# EAGLE design v2 (EAGLE 9.5.0)

## Sheet 1 of 6
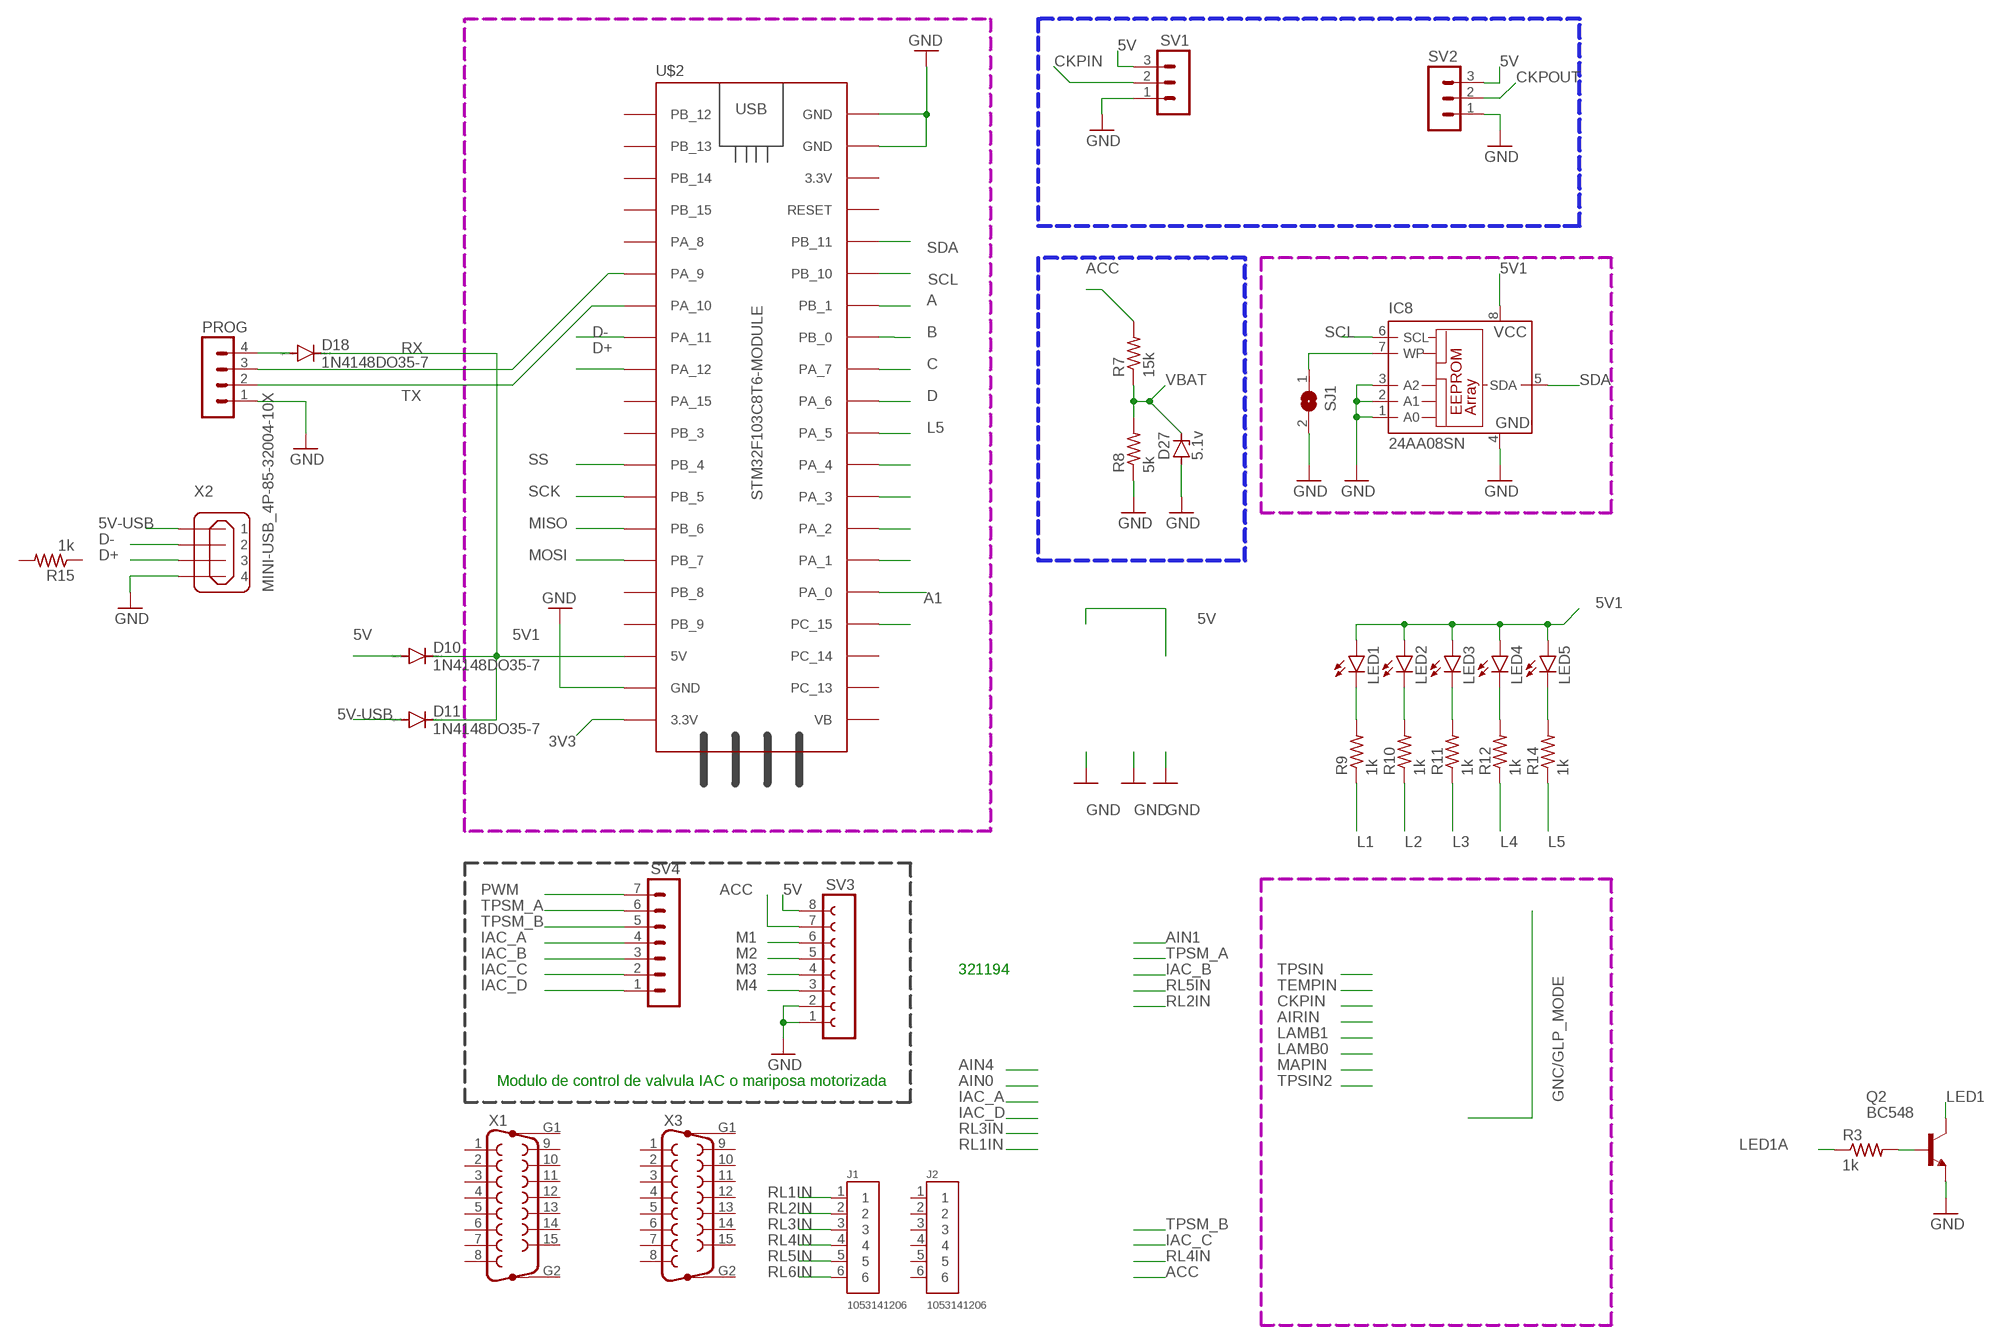
[diagram p0: schematic, sheet 1]

### Parts
D10  1N4148DO35-7  [DO35-7]
D11  1N4148DO35-7  [DO35-7]
D18  1N4148DO35-7  [DO35-7]
D27  5.1v  ZENER-DIODEZD-5  [ZDIO-5]
IC8  24AA08SN  [SO-08]
J1  1053141206  [MOLEX_1053141206]
J2  1053141206  [MOLEX_1053141206]
LED1  LED3MM  [LED3MM]
LED2  LED3MM  [LED3MM]
LED3  LED3MM  [LED3MM]
LED4  LED3MM  [LED3MM]
LED5  LED3MM  [LED3MM]
PROG  MA04-1  [MA04-1]
Q2  BC548  [TO92-EBC]
R3  1k  R-US_0204/5  [0204/5]
R7  15k  R-US_0204/5  [0204/5]
R8  5k  R-US_0204/5  [0204/5]
R9  1k  R-US_0204/5  [0204/5]
R10  1k  R-US_0204/5  [0204/5]
R11  1k  R-US_0204/5  [0204/5]
R12  1k  R-US_0204/5  [0204/5]
R14  1k  R-US_0204/5  [0204/5]
R15  1k  R-US_0204/5  [0204/5]
SJ1  SJW  [SJW]
SV1  MA03-1  [MA03-1]
SV2  MA03-1  [MA03-1]
SV3  FE08-1  [FE08]
SV4  MA07-1  [MA07-1]
U$2  STM32F103C8T6-MODULE  [STM32F103C8T6-MODULE]
X1  F15HP  [F15HP]
X2  MINI-USB_4P-85-32004-10X  [85-32004-10X]
X3  F15HP  [F15HP]

### Nets
3V3: U$2.3.3V_1(3.3V) ; also sheet 4
5V: D10.A SV1.3 SV2.3 SV3.8 ; also sheet 2,5
5V1: D10.C D11.C D18.C IC8.8(VCC) LED1.A LED2.A LED3.A LED4.A LED5.A U$2.5V
5V-USB: D11.A X2.1
A: U$2.PB_1 ; also sheet 2
A1: U$2.PA_0 ; also sheet 4
ACC: R7.2 SV3.7 ; also sheet 3
B: U$2.PB_0 ; also sheet 2
C: U$2.PA_7 ; also sheet 2
CKPIN: SV1.2
CKPOUT: SV2.2 ; also sheet 2
D: U$2.PA_6 ; also sheet 2
D+: U$2.PA_12 X2.3
D-: U$2.PA_11 X2.2
GND: D27.A IC8.1(A0) IC8.2(A1) IC8.3(A2) IC8.4(GND) PROG.1 Q2.E R8.1 SJ1.2 SV1.1 SV2.1 SV3.1 SV3.2 U$2.GND_1(GND) U$2.GND_2(GND) U$2.GND_3(GND) X2.4 ; also sheet 2,3,4,5
IAC_A: SV4.4
IAC_B: SV4.3
IAC_C: SV4.2
IAC_D: SV4.1
L1: R9.1
L2: R10.1
L3: R11.1
L4: R12.1
L5: R14.1 U$2.PA_5
LED1: Q2.C
LED1A: R3.1
M1: SV3.6 ; also sheet 2
M2: SV3.5 ; also sheet 2
M3: SV3.4 ; also sheet 2
M4: SV3.3 ; also sheet 2
MISO: U$2.PB_6
MOSI: U$2.PB_7
N$12: LED1.K(C) R9.2
N$13: LED2.K(C) R10.2
N$14: Q2.B R3.2
N$15: LED3.K(C) R11.2
N$16: LED4.K(C) R12.2
N$17: LED5.K(C) R14.2
N$21: U$2.PC_15
N$22: U$2.PA_1
N$23: U$2.PA_2
N$24: U$2.PA_3
N$26: U$2.PA_4
N$34: IC8.7(WP) SJ1.1
N$35: D18.A PROG.4
PWM: SV4.7 ; also sheet 2
RL1IN: J1.1 ; also sheet 4
RL2IN: J1.2 ; also sheet 4
RL3IN: J1.3 ; also sheet 4
RL4IN: J1.4 ; also sheet 4
RL5IN: J1.5 ; also sheet 4
RL6IN: J1.6 ; also sheet 4
RX: PROG.3 U$2.PA_9
SCK: U$2.PB_5
SCL: IC8.6(SCL) U$2.PB_10 ; also sheet 2
SDA: IC8.5(SDA) U$2.PB_11 ; also sheet 2
SS: U$2.PB_4
TPSM_A: SV4.6
TPSM_B: SV4.5
TX: PROG.2 U$2.PA_10
VBAT: D27.C R7.1 R8.2 ; also sheet 2
Unconnected: J2.1 J2.2 J2.3 J2.4 J2.5 J2.6 R15.1 R15.2 U$2.3.3V_2(3.3V) U$2.PA_8 U$2.PA_15 U$2.PB_3 U$2.PB_8 U$2.PB_9 U$2.PB_12 U$2.PB_13 U$2.PB_14 U$2.PB_15 U$2.PC_13 U$2.PC_14 U$2.RESET U$2.VB X1.1 X1.2 X1.3 X1.4 X1.5 X1.6 X1.7 X1.8 X1.9 X1.10 X1.11 X1.12 X1.13 X1.14 X1.15 X1.G1 X1.G2 X3.1 X3.2 X3.3 X3.4 X3.5 X3.6 X3.7 X3.8 X3.9 X3.10 X3.11 X3.12 X3.13 X3.14 X3.15 X3.G1 X3.G2

### Notes on the sheet
- 321194
- Modulo de control de valvula IAC o mariposa motorizada

## Sheet 2 of 6: IO Principal
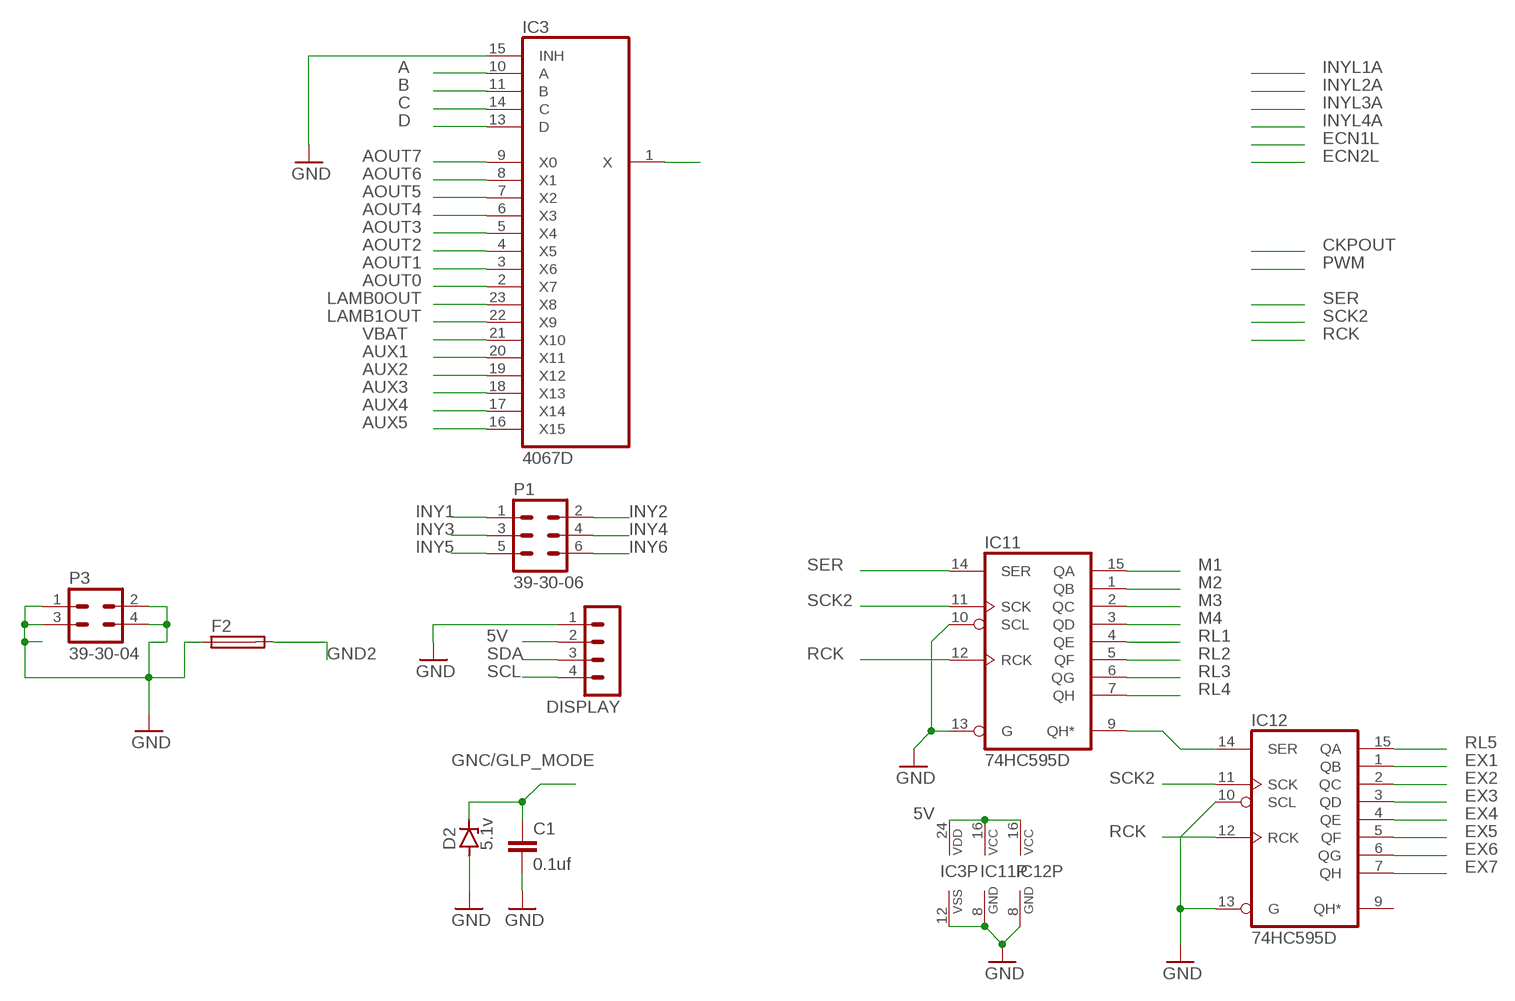
[diagram p1: schematic, sheet 2]

### Parts
C1  0.1uf  C-EU025-025X050  [C025-025X050]
D2  5.1v  ZENER-DIODEZD-5  [ZDIO-5]
DISPLAY  MA04-1  [MA04-1]
F2  TE5  [TE5]
IC3  4067D  [SO24W]
IC11  74HC595D  [SO16]
IC12  74HC595D  [SO16]
P1  39-30-06  [39-30-?06?]
P3  39-30-04  [39-30-?04?]

### Nets
5V: DISPLAY.2 IC3.24(VDD) IC11.16(VCC) IC12.16(VCC) ; also sheet 1,5
A: IC3.10(A) ; also sheet 1
A0: IC3.1(X) ; also sheet 4
AOUT0: IC3.2(X7) ; also sheet 5
AOUT1: IC3.3(X6) ; also sheet 5
AOUT2: IC3.4(X5) ; also sheet 5
AOUT3: IC3.5(X4) ; also sheet 5
AOUT4: IC3.6(X3) ; also sheet 5
AOUT5: IC3.7(X2) ; also sheet 5
AOUT6: IC3.8(X1) ; also sheet 5
AOUT7: IC3.9(X0) ; also sheet 5
AUX1: IC3.20(X11)
AUX2: IC3.19(X12)
AUX3: IC3.18(X13)
AUX4: IC3.17(X14)
AUX5: IC3.16(X15)
B: IC3.11(B) ; also sheet 1
C: IC3.14(C) ; also sheet 1
D: IC3.13(D) ; also sheet 1
EX1: IC12.1(QB)
EX2: IC12.2(QC)
EX3: IC12.3(QD)
EX4: IC12.4(QE)
EX5: IC12.5(QF)
EX6: IC12.6(QG)
EX7: IC12.7(QH)
GNC/GLP_MODE: C1.1 D2.C ; also sheet 1
GND: C1.2 D2.A DISPLAY.1 F2.1 IC3.12(VSS) IC3.15(INH) IC11.8(GND) IC11.10(SCL) IC11.13(G) IC12.8(GND) IC12.10(SCL) IC12.13(G) P3.1 P3.2 P3.3 P3.4 ; also sheet 1,3,4,5
GND2: F2.2 ; also sheet 3
INY1: P1.1 ; also sheet 3
INY2: P1.2 ; also sheet 3
INY3: P1.3 ; also sheet 3
INY4: P1.4 ; also sheet 3
INY5: P1.5 ; also sheet 3
INY6: P1.6 ; also sheet 3
LAMB0OUT: IC3.23(X8) ; also sheet 5
LAMB1OUT: IC3.22(X9) ; also sheet 5
M1: IC11.15(QA) ; also sheet 1
M2: IC11.1(QB) ; also sheet 1
M3: IC11.2(QC) ; also sheet 1
M4: IC11.3(QD) ; also sheet 1
N$25: IC11.9(QH*) IC12.14(SER)
RCK: IC11.12(RCK) IC12.12(RCK)
RL1: IC11.4(QE) ; also sheet 4
RL2: IC11.5(QF) ; also sheet 4
RL3: IC11.6(QG) ; also sheet 4
RL4: IC11.7(QH) ; also sheet 4
RL5: IC12.15(QA) ; also sheet 4
SCK2: IC11.11(SCK) IC12.11(SCK)
SCL: DISPLAY.4 ; also sheet 1
SDA: DISPLAY.3 ; also sheet 1
SER: IC11.14(SER)
VBAT: IC3.21(X10) ; also sheet 1
Unconnected: IC12.9(QH*)

## Sheet 3 of 6: Inyectores/Encendido
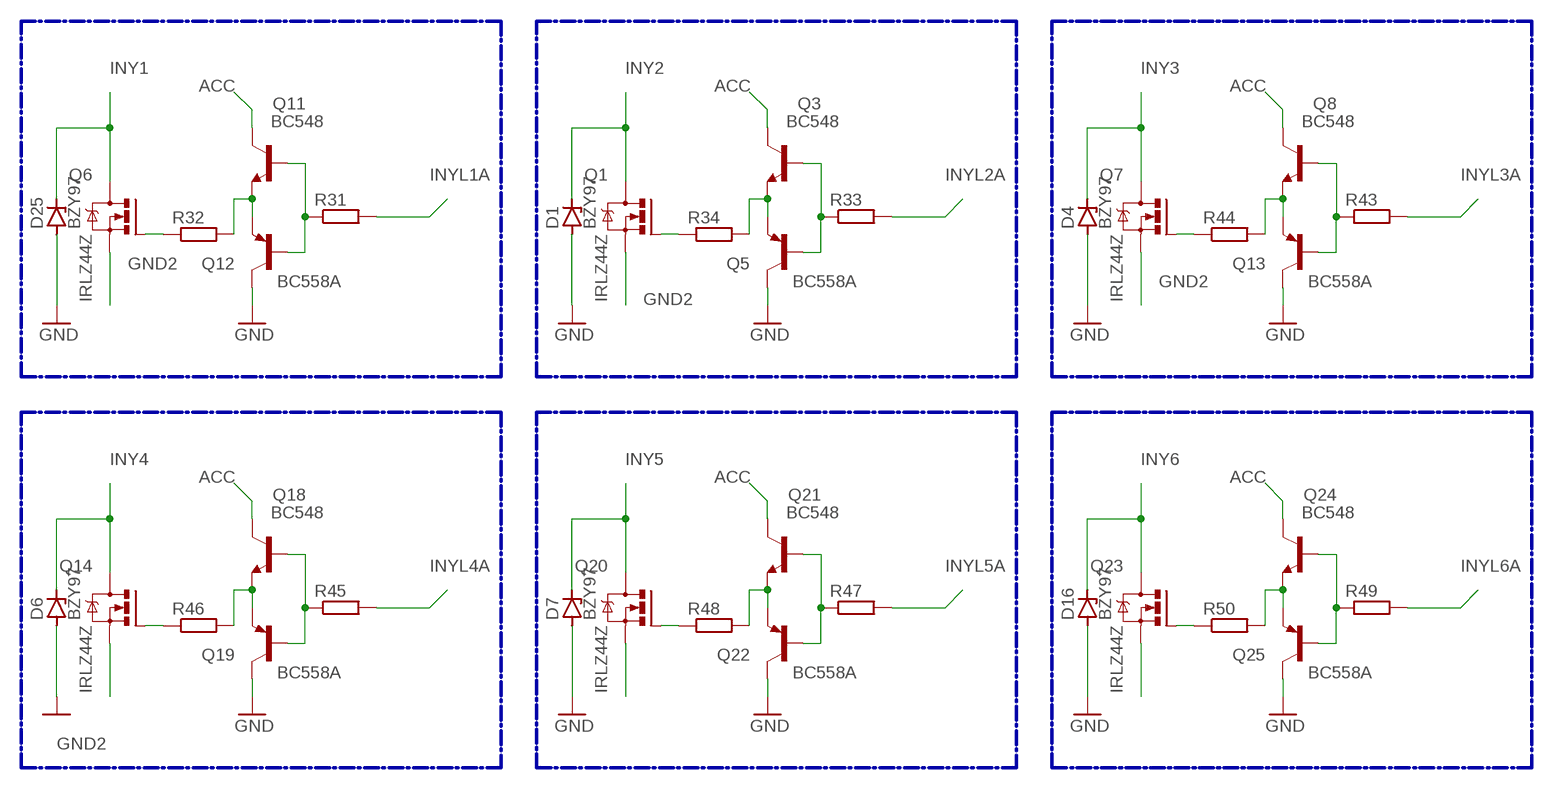
[diagram p2: schematic, sheet 3]

### Parts
D1  BZY97  [F126Z12]
D4  BZY97  [F126Z12]
D6  BZY97  [F126Z12]
D7  BZY97  [F126Z12]
D16  BZY97  [F126Z12]
D25  BZY97  [F126Z12]
Q1  IRLZ44Z  [TO220BH]
Q3  BC548  [TO92-EBC]
Q5  BC558A  [TO92-EBC]
Q6  IRLZ44Z  [TO220BH]
Q7  IRLZ44Z  [TO220BH]
Q8  BC548  [TO92-EBC]
Q11  BC548  [TO92-EBC]
Q12  BC558A  [TO92-EBC]
Q13  BC558A  [TO92-EBC]
Q14  IRLZ44Z  [TO220BH]
Q18  BC548  [TO92-EBC]
Q19  BC558A  [TO92-EBC]
Q20  IRLZ44Z  [TO220BH]
Q21  BC548  [TO92-EBC]
Q22  BC558A  [TO92-EBC]
Q23  IRLZ44Z  [TO220BH]
Q24  BC548  [TO92-EBC]
Q25  BC558A  [TO92-EBC]
R31  R-EU_0207/10  [0207/10]
R32  R-EU_0207/10  [0207/10]
R33  R-EU_0207/10  [0207/10]
R34  R-EU_0207/10  [0207/10]
R43  R-EU_0207/10  [0207/10]
R44  R-EU_0207/10  [0207/10]
R45  R-EU_0207/10  [0207/10]
R46  R-EU_0207/10  [0207/10]
R47  R-EU_0207/10  [0207/10]
R48  R-EU_0207/10  [0207/10]
R49  R-EU_0207/10  [0207/10]
R50  R-EU_0207/10  [0207/10]

### Nets
ACC: Q3.C Q8.C Q11.C Q18.C Q21.C Q24.C ; also sheet 1
GND: D1.A D4.A D6.A D7.A D16.A D25.A Q5.C Q12.C Q13.C Q19.C Q22.C Q25.C ; also sheet 1,2,4,5
GND2: Q1.S Q6.S Q7.S Q14.S Q20.S Q23.S ; also sheet 2
INY1: D25.C Q6.D ; also sheet 2
INY2: D1.C Q1.D ; also sheet 2
INY3: D4.C Q7.D ; also sheet 2
INY4: D6.C Q14.D ; also sheet 2
INY5: D7.C Q20.D ; also sheet 2
INY6: D16.C Q23.D ; also sheet 2
INYL1A: R31.2 ; also sheet 2
INYL2A: R33.2 ; also sheet 2
INYL3A: R43.2 ; also sheet 2
INYL4A: R45.2 ; also sheet 2
INYL5A: R47.2
INYL6A: R49.2
N$2: Q11.B Q12.B R31.1
N$3: Q11.E Q12.E R32.2
N$5: Q3.B Q5.B R33.1
N$6: Q6.G R32.1
N$9: Q3.E Q5.E R34.2
N$10: Q1.G R34.1
N$18: Q8.B Q13.B R43.1
N$20: Q8.E Q13.E R44.2
N$27: Q7.G R44.1
N$28: Q18.B Q19.B R45.1
N$30: Q18.E Q19.E R46.2
N$33: Q14.G R46.1
N$46: Q21.B Q22.B R47.1
N$47: Q21.E Q22.E R48.2
N$48: Q20.G R48.1
N$49: Q24.B Q25.B R49.1
N$50: Q24.E Q25.E R50.2
N$52: Q23.G R50.1

### Buses
B$1

## Sheet 4 of 6: Relay
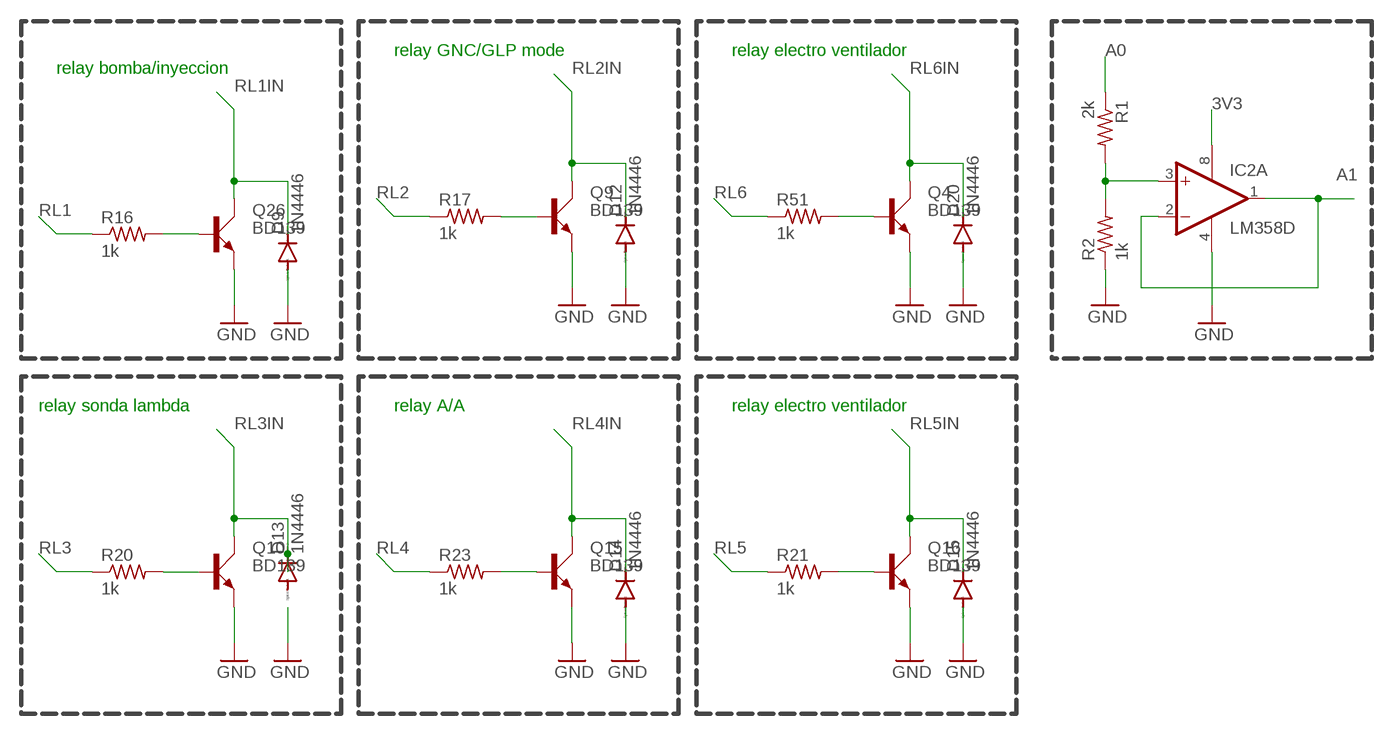
[diagram p3: schematic, sheet 4]

### Parts
D9  1N4446  [DO35-10]
D12  1N4446  [DO35-10]
D13  1N4446  [DO35-10]
D14  1N4446  [DO35-10]
D15  1N4446  [DO35-10]
D20  1N4446  [DO35-10]
IC2  LM358D  [SO08]
Q4  BD139  [TO126AV]
Q9  BD139  [TO126AV]
Q10  BD139  [TO126AV]
Q15  BD139  [TO126AV]
Q16  BD139  [TO126AV]
Q26  BD139  [TO126AV]
R1  2k  R-US_0204/5  [0204/5]
R2  1k  R-US_0204/5  [0204/5]
R16  1k  R-US_0204/5  [0204/5]
R17  1k  R-US_0204/5  [0204/5]
R20  1k  R-US_0204/5  [0204/5]
R21  1k  R-US_0204/5  [0204/5]
R23  1k  R-US_0204/5  [0204/5]
R51  1k  R-US_0204/5  [0204/5]

### Nets
3V3: IC2.8(P:V+) ; also sheet 1
A0: R1.1 ; also sheet 2
A1: IC2.1(A:OUT) IC2.2(A:-IN) ; also sheet 1
GND: D9.A D12.A D14.A D15.A D20.A IC2.4(P:V-) Q4.E Q9.E Q10.E Q15.E Q16.E Q26.E R2.1 ; also sheet 1,2,3,5
N$4: Q26.B R16.2
N$7: Q16.B R21.2
N$8: Q9.B R17.2
N$11: IC2.3(A:+IN) R1.2 R2.2
N$19: Q10.B R20.2
N$29: Q15.B R23.2
N$36: Q4.B R51.2
RL1: R16.1 ; also sheet 2
RL1IN: D9.C Q26.C ; also sheet 1
RL2: R17.1 ; also sheet 2
RL2IN: D12.C Q9.C ; also sheet 1
RL3: R20.1 ; also sheet 2
RL3IN: D13.C Q10.C ; also sheet 1
RL4: R23.1 ; also sheet 2
RL4IN: D14.C Q15.C ; also sheet 1
RL5: R21.1 ; also sheet 2
RL5IN: D15.C Q16.C ; also sheet 1
RL6: R51.1
RL6IN: D20.C Q4.C ; also sheet 1
Unconnected: D13.A IC2.5(B:+IN) IC2.6(B:-IN) IC2.7(B:OUT)

### Notes on the sheet
- relay GNC/GLP mode | relay electro ventilador
- relay bomba/inyeccion
- relay sonda lambda | relay A/A | relay electro ventilador

## Sheet 5 of 6: Sensores
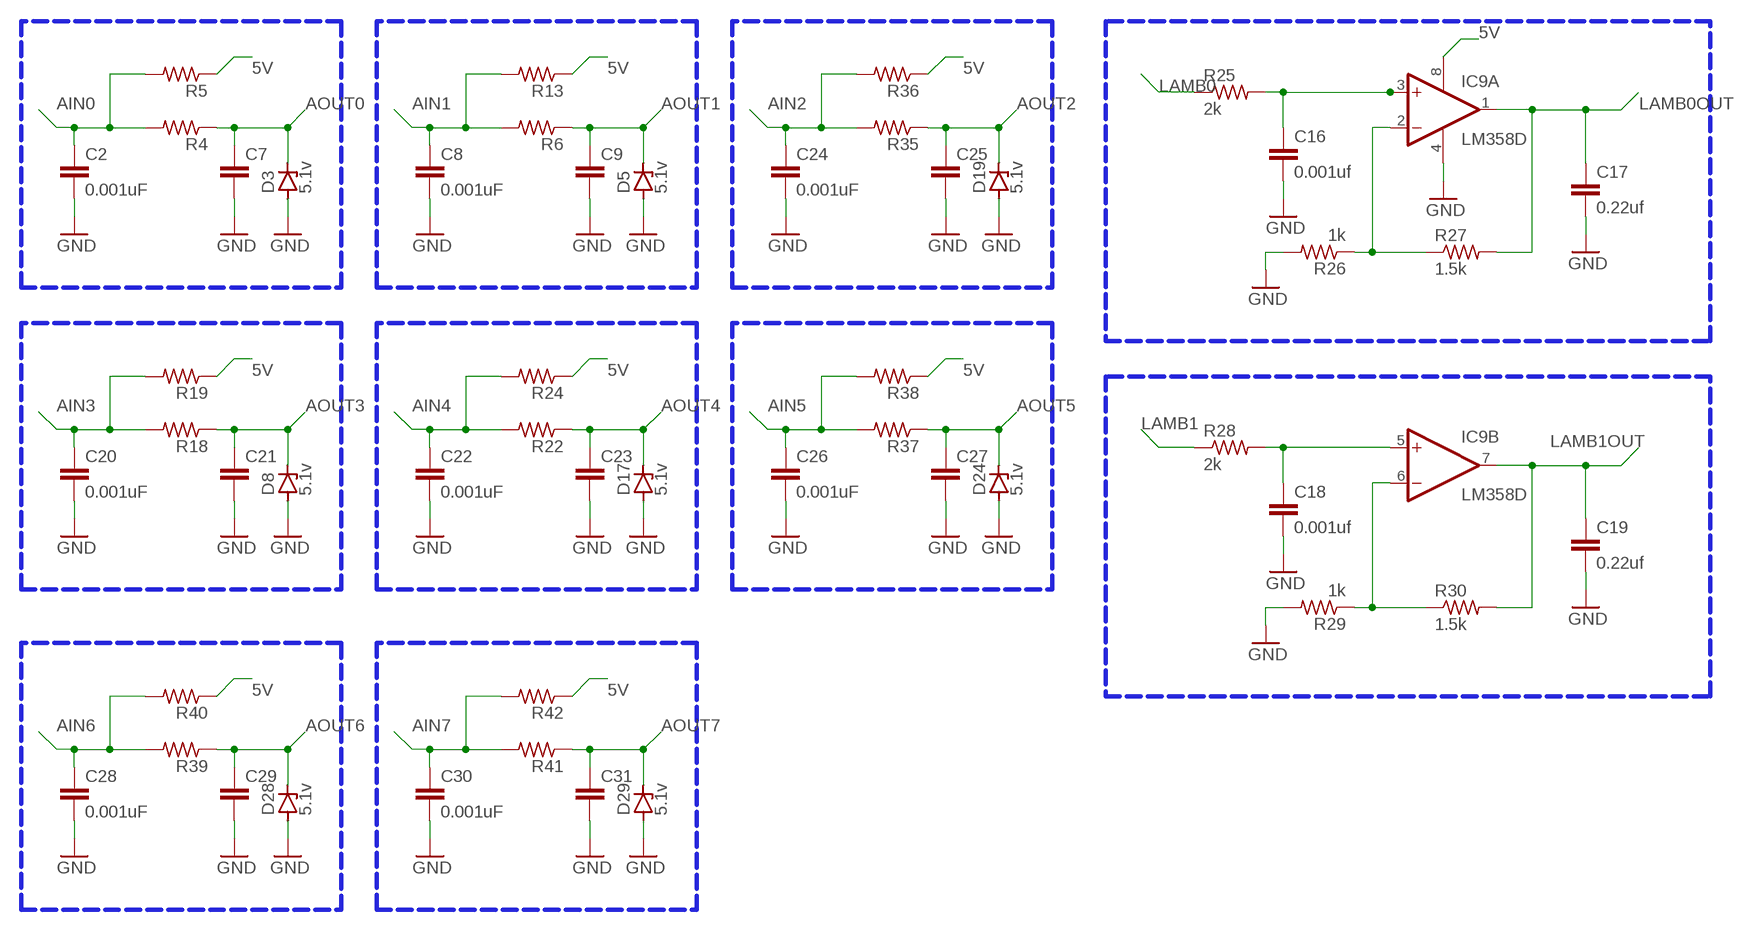
[diagram p4: schematic, sheet 5]

### Parts
C2  0.001uF  C-EU025-025X050  [C025-025X050]
C7  C-EU025-025X050  [C025-025X050]
C8  0.001uF  C-EU025-025X050  [C025-025X050]
C9  C-EU025-025X050  [C025-025X050]
C16  0.001uf  C-EU025-025X050  [C025-025X050]
C17  0.22uf  C-EU025-025X050  [C025-025X050]
C18  0.001uf  C-EU025-025X050  [C025-025X050]
C19  0.22uf  C-EU025-025X050  [C025-025X050]
C20  0.001uF  C-EU025-025X050  [C025-025X050]
C21  C-EU025-025X050  [C025-025X050]
C22  0.001uF  C-EU025-025X050  [C025-025X050]
C23  C-EU025-025X050  [C025-025X050]
C24  0.001uF  C-EU025-025X050  [C025-025X050]
C25  C-EU025-025X050  [C025-025X050]
C26  0.001uF  C-EU025-025X050  [C025-025X050]
C27  C-EU025-025X050  [C025-025X050]
C28  0.001uF  C-EU025-025X050  [C025-025X050]
C29  C-EU025-025X050  [C025-025X050]
C30  0.001uF  C-EU025-025X050  [C025-025X050]
C31  C-EU025-025X050  [C025-025X050]
D3  5.1v  ZENER-DIODEZD-5  [ZDIO-5]
D5  5.1v  ZENER-DIODEZD-5  [ZDIO-5]
D8  5.1v  ZENER-DIODEZD-5  [ZDIO-5]
D17  5.1v  ZENER-DIODEZD-5  [ZDIO-5]
D19  5.1v  ZENER-DIODEZD-5  [ZDIO-5]
D24  5.1v  ZENER-DIODEZD-5  [ZDIO-5]
D28  5.1v  ZENER-DIODEZD-5  [ZDIO-5]
D29  5.1v  ZENER-DIODEZD-5  [ZDIO-5]
IC9  LM358D  [SO08]
R4  R-US_0204/5  [0204/5]
R5  R-US_0204/5  [0204/5]
R6  R-US_0204/5  [0204/5]
R13  R-US_0204/5  [0204/5]
R18  R-US_0204/5  [0204/5]
R19  R-US_0204/5  [0204/5]
R22  R-US_0204/5  [0204/5]
R24  R-US_0204/5  [0204/5]
R25  2k  R-US_0204/5  [0204/5]
R26  1k  R-US_0204/5  [0204/5]
R27  1.5k  R-US_0204/5  [0204/5]
R28  2k  R-US_0204/5  [0204/5]
R29  1k  R-US_0204/5  [0204/5]
R30  1.5k  R-US_0204/5  [0204/5]
R35  R-US_0204/5  [0204/5]
R36  R-US_0204/5  [0204/5]
R37  R-US_0204/5  [0204/5]
R38  R-US_0204/5  [0204/5]
R39  R-US_0204/5  [0204/5]
R40  R-US_0204/5  [0204/5]
R41  R-US_0204/5  [0204/5]
R42  R-US_0204/5  [0204/5]

### Nets
5V: IC9.8(P:V+) R5.1 R13.1 R19.1 R24.1 R36.1 R38.1 R40.1 R42.1 ; also sheet 1,2
AIN0: C2.1 R4.2 R5.2 ; also sheet 1
AIN1: C8.1 R6.2 R13.2 ; also sheet 1
AIN2: C24.1 R35.2 R36.2
AIN3: C20.1 R18.2 R19.2
AIN4: C22.1 R22.2 R24.2 ; also sheet 1
AIN5: C26.1 R37.2 R38.2
AIN6: C28.1 R39.2 R40.2
AIN7: C30.1 R41.2 R42.2
AOUT0: C7.1 D3.C R4.1 ; also sheet 2
AOUT1: C9.1 D5.C R6.1 ; also sheet 2
AOUT2: C25.1 D19.C R35.1 ; also sheet 2
AOUT3: C21.1 D8.C R18.1 ; also sheet 2
AOUT4: C23.1 D17.C R22.1 ; also sheet 2
AOUT5: C27.1 D24.C R37.1 ; also sheet 2
AOUT6: C29.1 D28.C R39.1 ; also sheet 2
AOUT7: C31.1 D29.C R41.1 ; also sheet 2
GND: C2.2 C7.2 C8.2 C9.2 C16.2 C17.2 C18.2 C19.2 C20.2 C21.2 C22.2 C23.2 C24.2 C25.2 C26.2 C27.2 C28.2 C29.2 C30.2 C31.2 D3.A D5.A D8.A D17.A D19.A D24.A D28.A D29.A IC9.4(P:V-) R26.2 R29.2 ; also sheet 1,2,3,4
LAMB0: R25.1 ; also sheet 1
LAMB0OUT: C17.1 IC9.1(A:OUT) R27.2 ; also sheet 2
LAMB1: R28.1 ; also sheet 1
LAMB1OUT: C19.1 IC9.7(B:OUT) R30.2 ; also sheet 2
N$1: C18.1 IC9.5(B:+IN) R28.2
N$31: C16.1 IC9.3(A:+IN) R25.2
N$32: IC9.2(A:-IN) R26.1 R27.1
N$37: IC9.6(B:-IN) R29.1 R30.1

## Sheet 6 of 6: Fuente

## Library data of the parts
C1 C2 C7-C9 C16-C31 = rcl:C-EU: CAPACITOR, European symbol; SPICEPREFIX: C
D1 D4 D6 D7 D16 D25 = diode:BZY97: Z DIODE
D2 D3 D5 D8 D17 D19 D24 D27-D29 = diode:ZENER-DIODE: Z-Diode
D9 D12-D15 D20 = diode:1N4446: DIODE high speed (Philips)
D10 D11 D18 = diode:1N4148: DIODE high speed (Philips)
DISPLAY PROG = con-lstb:MA04-1: PIN HEADER; OC_FARNELL: unknown; OC_NEWARK: unknown
F2 = fuse:TE5: FUSE Wickmann; OC_FARNELL: unknown; OC_NEWARK: unknown
IC2 IC9 = linear:LM358: OP AMP also LM158; LM258; LM2904 Source: http://cache.national.com/ds/LM/LM158.pdf
IC3 = 40xx:4067: 16-channel ANALOG MULTIPLEXER
IC8 = microchip:24*: Serial EEPROM I2C; MF: MICROCHIP; MPN: 24AA08-I/SN; OC_FARNELL: 1579568; OC_NEWARK: 92C6826
IC11 IC12 = 74xx-eu:74*595: 8-bit SHIFT REGISTER, output latch
J1 J2 = 1053141206:1053141206: Nano-Fit Right Angle Header; Through Hole; 2.50mm; Dual Row; 6 Circuit; Gold Plating; AVAILABILITY: Unavailable; DESCRIPTION: Nano-Fit Right Angle Header; Through Hole; 2.50mm; Dual Row; 6 Circuit; Gold Plating; MF: Molex; MP: 1053141206; PACKAGE: 1206 Molex; PRICE: None
LED1-LED5 = led:LED: LED OSRAM: - CHIPLED LG R971, LG N971, LY N971, LG Q971, LY Q971, LO R971, LY R971 LH N974, LH R974 LS Q976, LO Q976, LY Q976 LO Q996 - Hyper CHIPLED LW Q18S LB Q993, LB Q99A, LB R99A - SideLED LS A670, LO A670, LY A670, LG A670, LP A670 LB A673, LV A673, LT A673, LW A673 LH A674 LY A675 LS A676, LA A676, LO A676, LY A676, LW A676 LS A679, LY A679, LG A679 - Hyper Micro SIDELED® LS Y876, LA Y876, LO Y876, LY Y876 LT Y87S - SmartLED LW L88C, LW L88S LB L89C, LB L89S, LG L890 LS L89K, LO L89K, LY L89K LS L896, LA L896, LO L896, LY L896 - TOPLED LS T670, LO T670, LY T670, LG T670, LP T670 LSG T670, LSP T670, LSY T670, LOP T670, LYG T670 LG T671, LOG T671, LSG T671 LB T673, LV T673, LT T673, LW T673 LH T674 LS T676, LA T676, LO T676, LY T676, LB T676, LH T676, LSB T676, LW T676 LB T67C, LV T67C, LT T67C, LS T67K, LO T67K, LY T67K, LW E67C LS E67B, LA E67B, LO E67B, LY E67B, LB E67C, LV E67C, LT E67C LW T67C LS T679, LY T679, LG T679 LS T770, LO T770, LY T770, LG T770, LP T770 LB T773, LV T773, LT T773, LW T773 LH T774 LS E675, LA E675, LY E675, LS T675 LS T776, LA T776, LO T776, LY T776, LB T776 LHGB T686 LT T68C, LB T68C - Hyper Mini TOPLED® LB M676 - Mini TOPLED Santana® LG M470 LS M47K, LO M47K, LY M47K Source: http://www.osram.convergy.de LUXEON: - LUMILED® LXK2-PW12-R00, LXK2-PW12-S00, LXK2-PW14-U00, LXK2-PW14-V00 LXK2-PM12-R00, LXK2-PM12-S00, LXK2-PM14-U00 LXK2-PE12-Q00, LXK2-PE12-R00, LXK2-PE12-S00, LXK2-PE14-T00, LXK2-PE14-U00 LXK2-PB12-K00, LXK2-PB12-L00, LXK2-PB12-M00, LXK2-PB14-N00, LXK2-PB14-P00, LXK2-PB14-Q00 LXK2-PR12-L00, LXK2-PR12-M00, LXK2-PR14-Q00, LXK2-PR14-R00 LXK2-PD12-Q00, LXK2-PD12-R00, LXK2-PD12-S00 LXK2-PH12-R00, LXK2-PH12-S00 LXK2-PL12-P00, LXK2-PL12-Q00, LXK2-PL12-R00 Source: www.luxeon.com KINGBRIGHT: KA-3528ASYC Source: www.kingbright.com
P1 = con-molex-mini-fit:39-30-?06?: HEADER
P3 = con-molex-mini-fit:39-30-?04?: HEADER
Q1 Q6 Q7 Q14 Q20 Q23 = transistor-power:IRLZ44Z: N-Channel HEXFET® Power MOSFET Logic Level AUTOMOTIVE MOSFET Source: http://www.irf.com/product-info/datasheets/data/irlz44zpbf.pdf
Q2 Q3 Q8 Q11 Q18 Q21 Q24 = transistor-npn:BC548*: NPN Transistor
Q4 Q9 Q10 Q15 Q16 Q26 = transistor-power:BD139: NPN TRANSISTOR
Q5 Q12 Q13 Q19 Q22 Q25 = transistor-pnp:BC558*: PNP Transistror
R1-R30 R35-R42 R51 = rcl:R-US_: RESISTOR, American symbol; SPICEPREFIX: R
R31-R34 R43-R50 = rcl:R-EU_: RESISTOR, European symbol; SPICEPREFIX: R
SJ1 = jumper:SJ: SMD solder JUMPER
SV1 SV2 = con-lstb:MA03-1: PIN HEADER; OC_FARNELL: unknown; OC_NEWARK: unknown
SV3 = con-lsta:FE08-1: FEMALE HEADER; OC_FARNELL: unknown; OC_NEWARK: unknown
SV4 = con-lstb:MA07-1: PIN HEADER; OC_FARNELL: unknown; OC_NEWARK: unknown
U$2 = stm32f103c8t6_module:STM32F103C8T6-MODULE: STM32F103C8T6 module with ARM Cortex-3, 20kB SRAM, 64kB Flash, 72MHz
X1 X3 = con-subd:F15HP: SUB-D; OC_FARNELL: unknown; OC_NEWARK: unknown
X2 = con-cypressindustries:MINI-USB_4P-: MINI USB 4 Pol. Source: www.cypressindustries.com; OC_FARNELL: unknown; OC_NEWARK: unknown

## Board
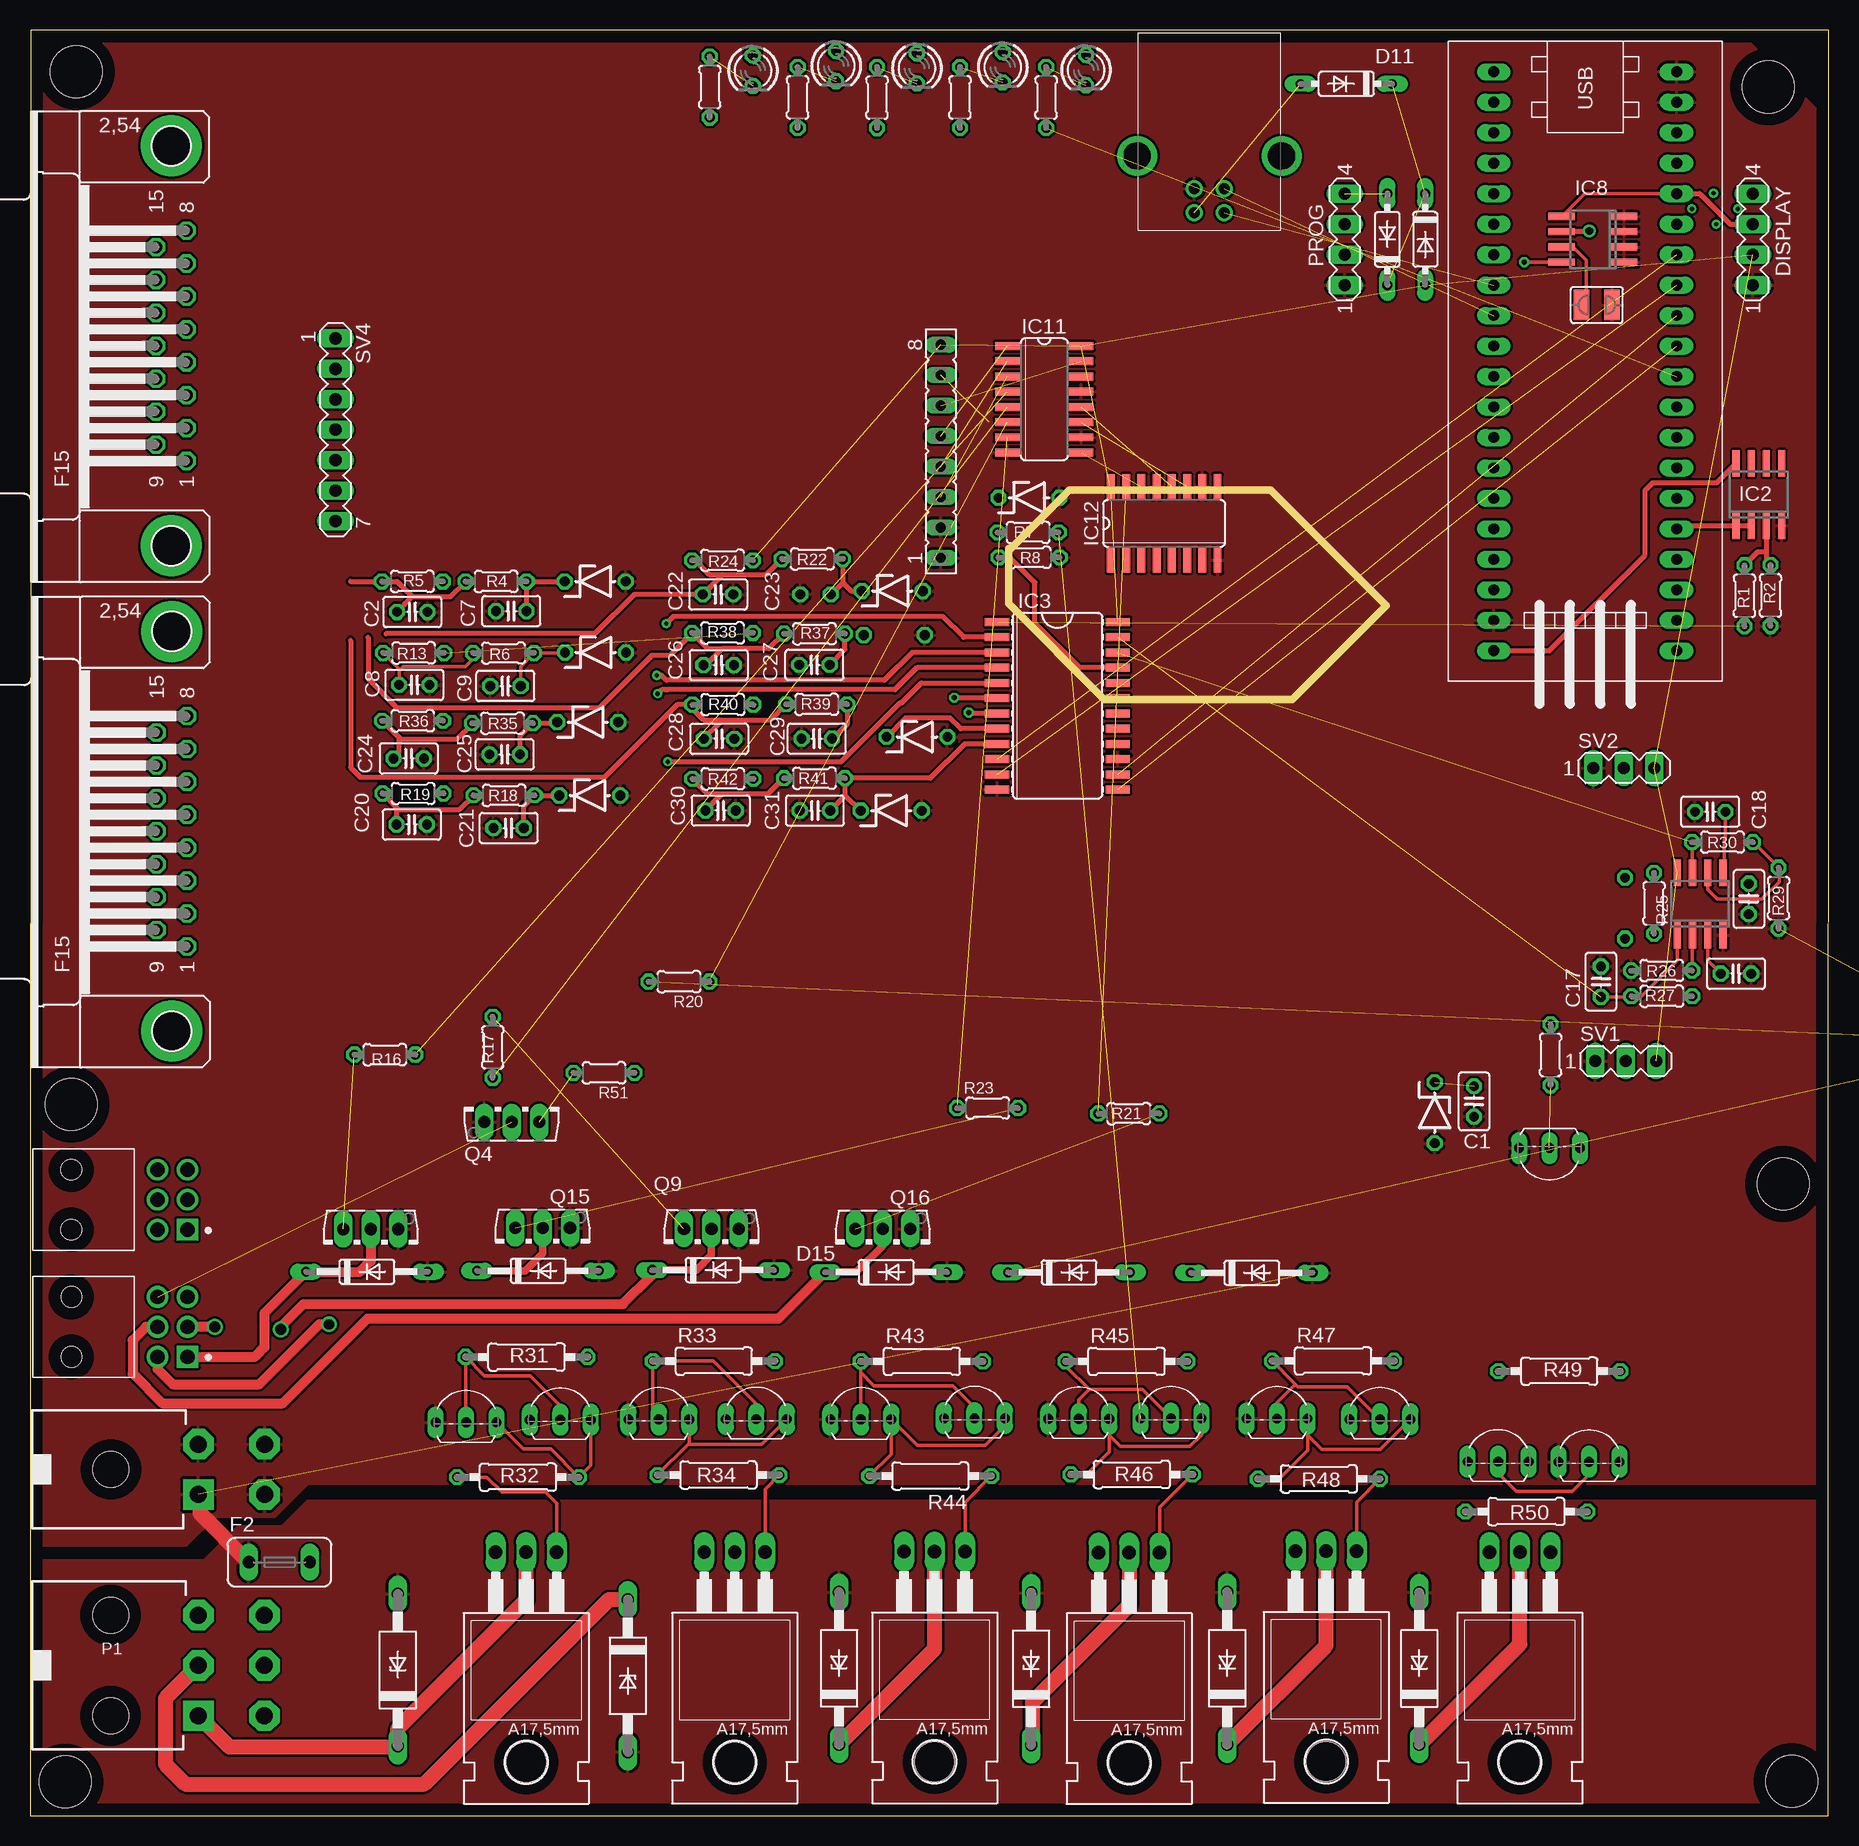
[diagram p5: board, top side]
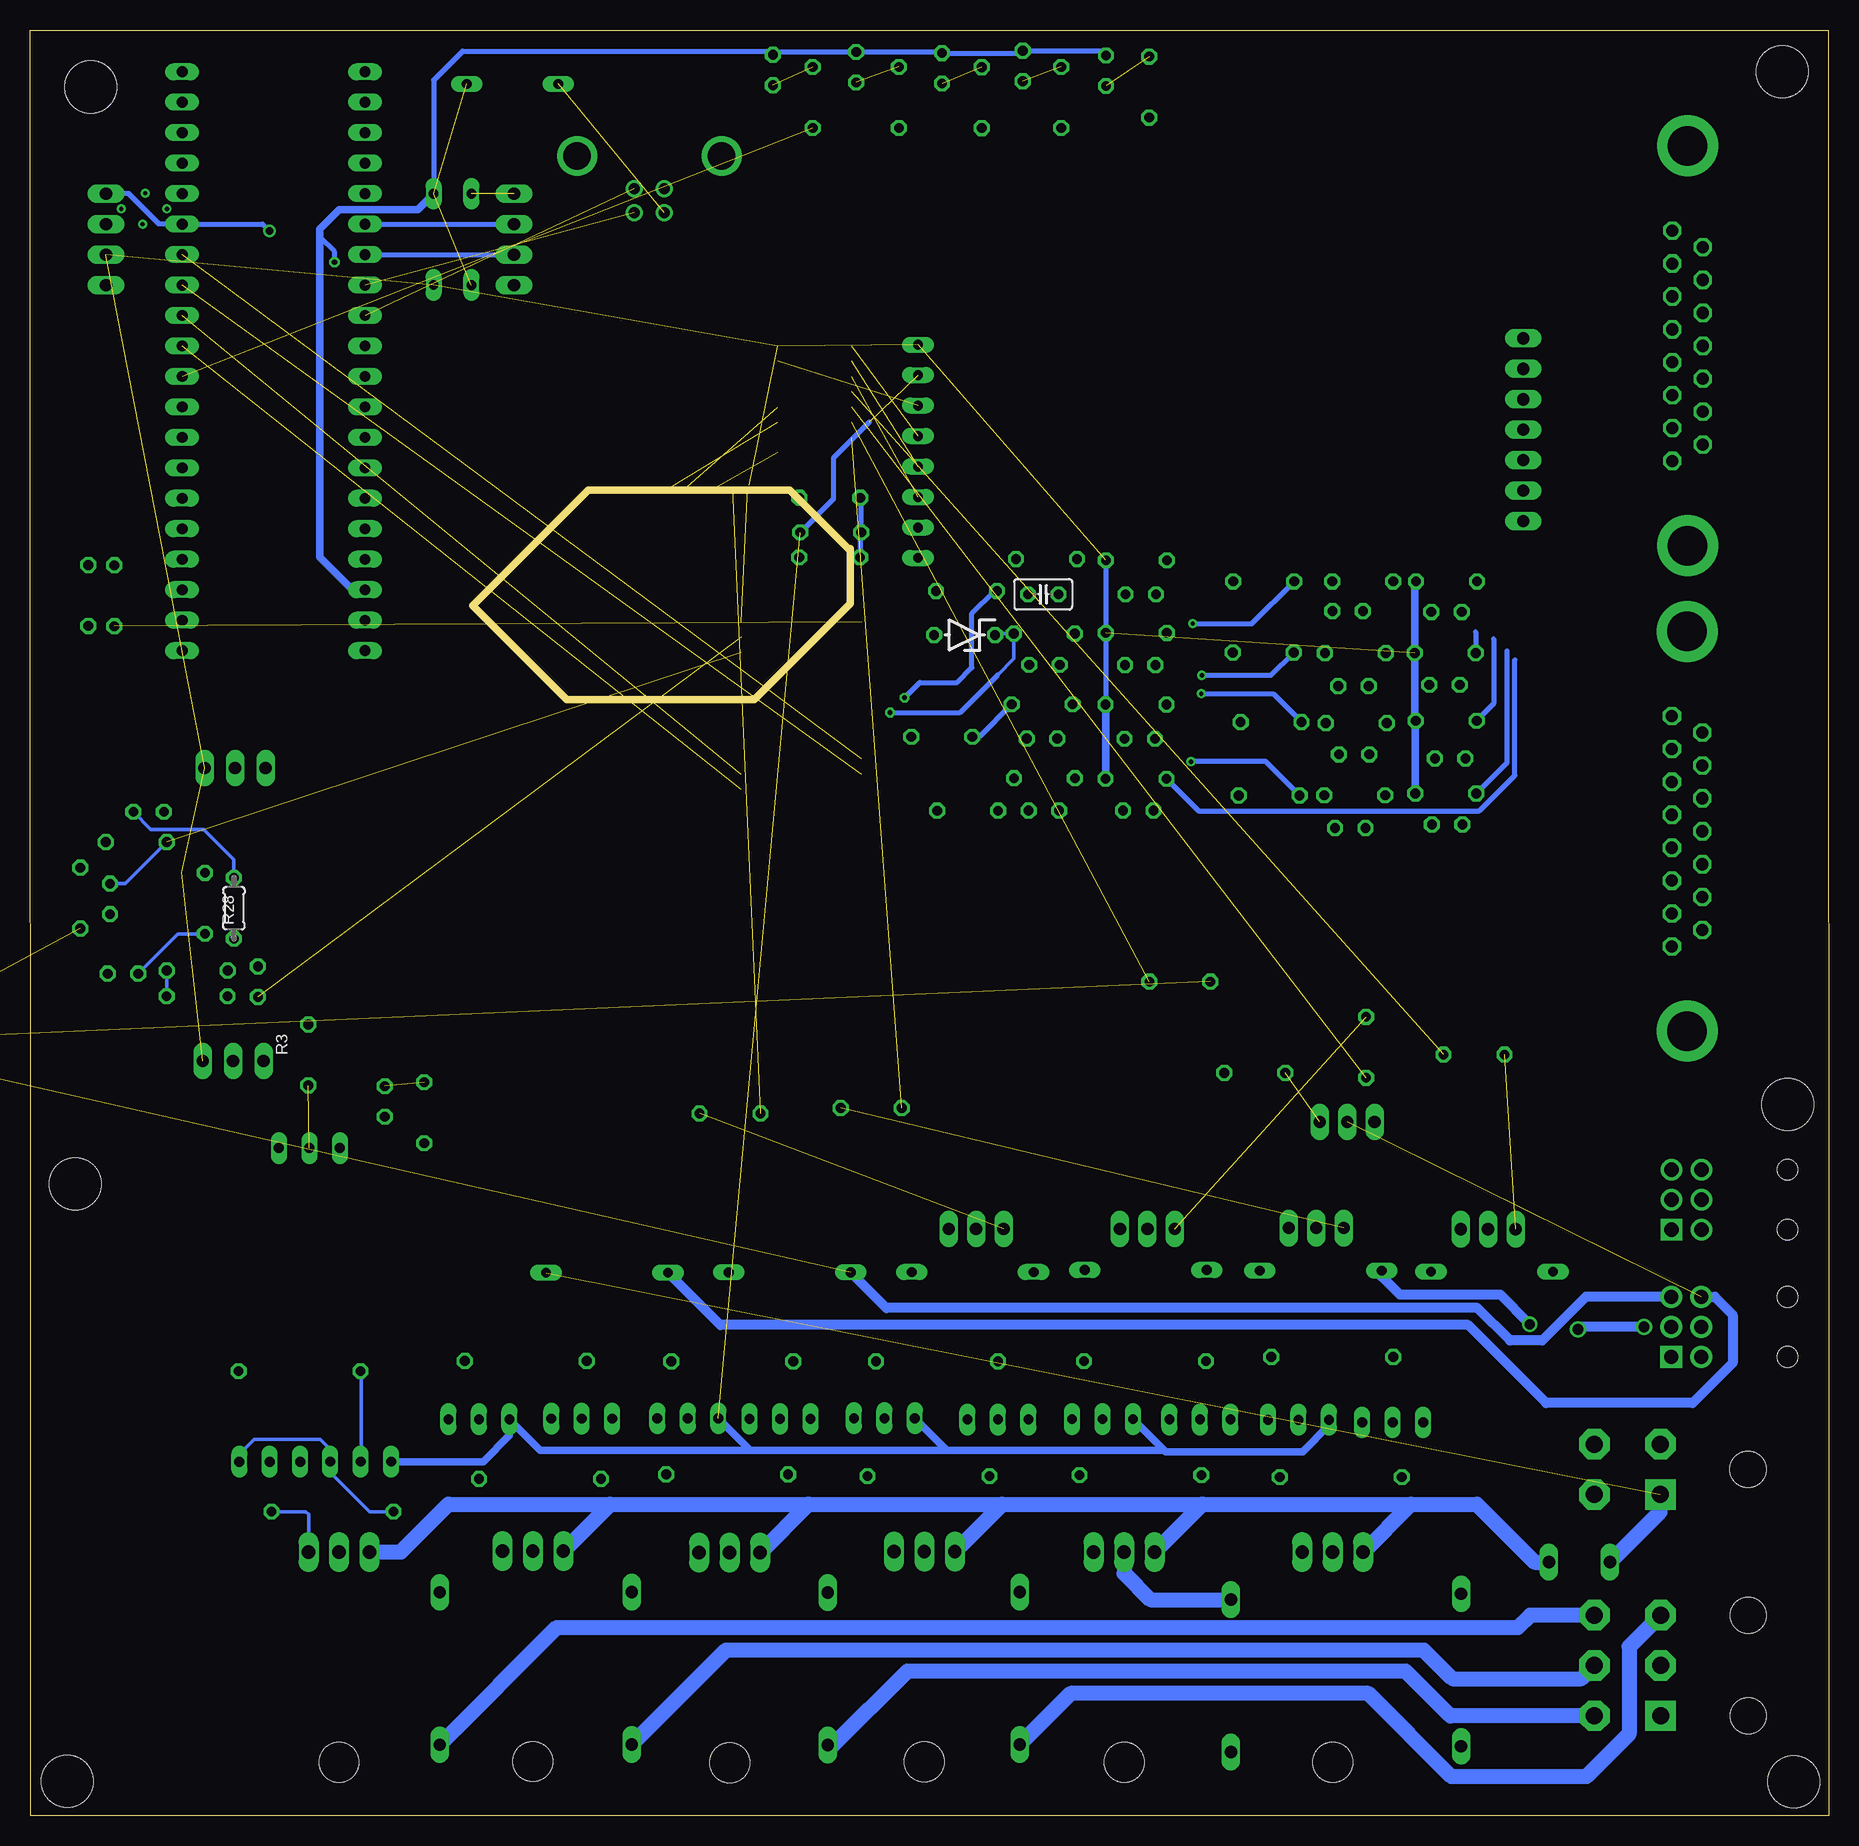
[diagram p6: board, bottom side, seen from below]

Size 149.9 x 148.84 mm. Coordinates in mm from the lower left corner, seen from the top.
Outline: 0,0 149.84,0 149.9,148.84 0.06,148.84 0,0
Copper layers (1*16): Top 0.035mm / dielectric 1.5mm / Bottom 0.035mm
Design rules "default *": minimum track width 8mil, minimum drill 0.35mm, track to track 8mil, track to pad 8mil, pad to pad 8mil, via to via 8mil, smd to smd 8mil, copper to edge 40mil, drill to drill 8mil, minimum pad ring 10mil, minimum via ring 8mil, stop-mask expansion 4mil, vias tented up to drill 0mil, thermal gap 10mil
Holes 4.32 mm at 144.84,144.09 146.11,52.65 3.43,59.29 3.87,145.36 2.92,2.8 146.8,2.87
vRestrict: 7 lines
Milling: 7 lines

### Footprints (pad centres in the part's own frame; a part is rotated, then mirrored left to right if it is on the bottom)
C025-025X050 = drill 0.813 octagon: 1 -1.27,0; 2 1.27,0
F126Z12 = drill 1.016 long: A 6.35,0; C -6.35,0
ZDIO-5 = drill 0.813 octagon: A 2.54,0; C -2.54,0
DO35-10 = drill 0.813 long: A 5.08,0; C -5.08,0
DO35-7 = drill 0.813 long: A 3.81,0; C -3.81,0
MA04-1 = drill 1.016 long: 1 -3.81,0; 2 -1.27,0; 3 1.27,0; 4 3.81,0
TE5 = drill 1.016 long: 1 -2.54,0; 2 2.54,0
SO08 = smd 0.6 x 2.2: 1 -1.905,-2.6; 2 -0.635,-2.6; 3 0.635,-2.6; 4 1.905,-2.6; 5 1.905,2.6; 6 0.635,2.6; 7 -0.635,2.6; 8 -1.905,2.6
SO24W = smd 0.66 x 2.032: 1 -6.985,-5.029; 2 -5.715,-5.029; 3 -4.445,-5.029; 4 -3.175,-5.029; 5 -1.905,-5.029; 6 -0.635,-5.029; 7 0.635,-5.029; 8 1.905,-5.029; 9 3.175,-5.029; 10 4.445,-5.029; 11 5.715,-5.029; 12 6.985,-5.029; 13 6.985,5.029; 14 5.715,5.029; 15 4.445,5.029; 16 3.175,5.029; 17 1.905,5.029; 18 0.635,5.029; 19 -0.635,5.029; 20 -1.905,5.029; 21 -3.175,5.029; 22 -4.445,5.029; 23 -5.715,5.029; 24 -6.985,5.029
SO-08 = smd 0.6 x 2.2: 1 -1.905,-2.6; 2 -0.635,-2.6; 3 0.635,-2.6; 4 1.905,-2.6; 5 1.905,2.6; 6 0.635,2.6; 7 -0.635,2.6; 8 -1.905,2.6
SO16 = smd 0.66 x 2.032: 1 -4.445,-3.073; 2 -3.175,-3.073; 3 -1.905,-3.073; 4 -0.635,-3.073; 5 0.635,-3.073; 6 1.905,-3.073; 7 3.175,-3.073; 8 4.445,-3.073; 9 4.445,3.073; 10 3.175,3.073; 11 1.905,3.073; 12 0.635,3.073; 13 -0.635,3.073; 14 -1.905,3.073; 15 -3.175,3.073; 16 -4.445,3.073
MOLEX_1053141206 = drill 1.2 square: 1 2.5,6.44 | drill 1.2: 2 0,6.44; 3 -2.5,6.44; 4 2.5,3.94; 5 0,3.94; 6 -2.5,3.94 | hole 1.7: 2.5,-3.24; -2.5,-3.24
LED3MM = drill 0.813 octagon: A -1.27,0; K 1.27,0
39-30-?06? = drill 1.422 pad 2.54 square: 1 4.191,0 | drill 1.422 pad 2.54 octagon: 2 0,0; 3 -4.191,0; 4 4.191,5.512; 5 0,5.512; 6 -4.191,5.512 | hole 3: -4.191,-7.3; 4.191,-7.3
39-30-?04? = drill 1.422 pad 2.54 square: 1 2.095,0 | drill 1.422 pad 2.54 octagon: 2 -2.095,0; 3 2.095,5.512; 4 -2.095,5.512 | hole 3: 0,-7.3
TO220BH = drill 1.118 long: D 0,-6.35; G -2.54,-6.35; S 2.54,-6.35 | hole 3.302: 0,11.176
TO92-EBC = drill 0.813 long: B 0,-1.27; C -2.54,-1.27; E 2.54,-1.27
TO126AV = drill 1.016 long: B 2.286,-1.27; C 0,-1.27; E -2.286,-1.27
0204/5 = drill 0.813 octagon: 1 -2.54,0; 2 2.54,0
0207/10 = drill 0.813 octagon: 1 -5.08,0; 2 5.08,0
SJW = smd 1.27 x 2.54: 1 -1.27,0; 2 1.27,0
MA03-1 = drill 1.016 long: 1 -2.54,0; 2 0,0; 3 2.54,0
FE08 = drill 0.813 long: 1 -8.89,0; 2 -6.35,0; 3 -3.81,0; 4 -1.27,0; 5 1.27,0; 6 3.81,0; 7 6.35,0; 8 8.89,0
MA07-1 = drill 1.016 long: 1 -7.62,0; 2 -5.08,0; 3 -2.54,0; 4 0,0; 5 2.54,0; 6 5.08,0; 7 7.62,0
STM32F103C8T6-MODULE = drill 0.9 long: 3.3V_1 25.4,-7.62; 3.3V_2 -17.78,7.62; 5V 20.32,-7.62; GND_1 22.86,-7.62; GND_2 -20.32,7.62; GND_3 -22.86,7.62; PA_0 15.24,7.62; PA_1 12.7,7.62; PA_2 10.16,7.62; PA_3 7.62,7.62; PA_4 5.08,7.62; PA_5 2.54,7.62; PA_6 0,7.62; PA_7 -2.54,7.62; PA_8 -12.7,-7.62; PA_9 -10.16,-7.62; PA_10 -7.62,-7.62; PA_11 -5.08,-7.62; PA_12 -2.54,-7.62; PA_15 0,-7.62; PB_0 -5.08,7.62; PB_1 -7.62,7.62; PB_3 2.54,-7.62; PB_4 5.08,-7.62; PB_5 7.62,-7.62; PB_6 10.16,-7.62; PB_7 12.7,-7.62; PB_8 15.24,-7.62; PB_9 17.78,-7.62; PB_10 -10.16,7.62; PB_11 -12.7,7.62; PB_12 -22.86,-7.62; PB_13 -20.32,-7.62; PB_14 -17.78,-7.62; PB_15 -15.24,-7.62; PC_13 22.86,7.62; PC_14 20.32,7.62; PC_15 17.78,7.62; RESET -15.24,7.62; VB 25.4,7.62
F15HP = drill 1.016 octagon: 1 -9.601,-1.27; 2 -6.858,-1.27; 3 -4.115,-1.27; 4 -1.372,-1.27; 5 1.372,-1.27; 6 4.115,-1.27; 7 6.858,-1.27; 8 9.601,-1.27; 9 -8.23,1.27; 10 -5.486,1.27; 11 -2.743,1.27; 12 0,1.27; 13 2.743,1.27; 14 5.486,1.27; 15 8.23,1.27 | drill 3.302 pad 5.08: G1 -16.662,0; G2 16.662,0
85-32004-10X = drill 0.92 pad 1.27: 1 4.71,-1.25; 2 4.71,1.25; 3 2.71,1.25; 4 2.71,-1.25 | drill 2.3 pad 3: M1 0,6.02; M2 0,-6.02

### Placement (x,y rotation side)
C1  120.33,59.53 270 top
C2  31.86,100.33 0 top
C7  40.1,100.4 180 top
C8  32.03,94.25 0 top
C9  39.62,94.15 180 top
C16  142.16,70.18 0 top
C17  130.91,69.52 90 top
C18  140.02,83.67 180 top
C19  143.23,76.41 270 top
C20  31.81,82.61 0 top
C21  39.89,82.32 180 top
C22  57.34,101.79 0 top
C23  65.47,101.8 0 bottom
C24  31.56,88.12 0 top
C25  39.56,88.46 180 top
C26  57.39,95.9 0 top
C27  65.37,95.92 180 top
C28  57.42,89.76 0 top
C29  65.57,89.77 180 top
C30  57.55,83.78 0 top
C31  65.42,83.77 180 top
D1  49.82,11.65 270 top
D2  117.05,58.59 270 top
D3  47.1,102.87 0 top
D4  67.42,12.28 90 top
D5  47.13,96.95 0 top
D6  83.43,12.23 90 top
D7  99.77,12.27 90 top
D8  46.64,85.04 0 top
D9  28.08,45.34 0 top
D10  116.27,131.39 270 top
D11  109.69,144.35 180 top
D12  56.93,45.48 0 top
D13  86.59,45.28 0 top
D14  42.34,45.41 0 top
D15  71.35,45.31 0 top
D16  115.77,12.25 90 top
D17  71.86,102.08 0 top
D18  113.11,131.39 90 top
D19  46.48,91.15 0 top
D20  101.81,45.25 0 top
D24  72.02,98.41 180 bottom
D25  30.65,12.13 90 top
D27  83.25,109.85 0 top
D28  73.92,89.92 0 top
D29  71.77,83.76 0 top
DISPLAY  143.57,131.39 90 top
F2  20.78,21.12 0 top
IC2  144.06,110.11 0 top
IC3  85.62,92.51 270 top
IC8  130.24,131.39 90 top
IC9  139.18,75.99 0 top
IC11  84.52,118.05 270 top
IC12  94.52,107.71 0 top
J1  6.69,40.74 270 top
J2  6.68,51.34 270 top
LED1  60.24,145.45 270 top
LED2  67.17,145.84 270 top
LED3  73.9,145.65 270 top
LED4  81.05,145.74 270 top
LED5  88,145.5 270 top
P1  39-30-06?  [39-30-?06?]  14.02,12.51 270 top
P3  39-30-04?  [39-30-?04?]  14.04,28.85 270 top
PROG  109.56,131.39 90 top
Q1  58.73,15.62 180 top
Q2  126.62,54.37 180 top
Q3  60.53,34.32 0 top
Q4  40.14,59.08 0 top
Q5  52.41,34.29 0 top
Q6  41.35,15.61 180 top
Q7  75.38,15.65 180 top
Q8  78.7,34.39 0 top
Q9  56.79,47.64 180 top
Q10  165.75,65.67 0 top  (outside the outline)
Q11  44.19,34.26 0 top
Q12  36.34,34.04 0 top
Q13  69.24,34.29 0 top
Q14  91.6,15.57 180 top
Q15  42.72,47.7 180 top
Q16  71.06,47.63 180 top
Q18  95.09,34.38 0 top
Q19  87.4,34.34 0 top
Q20  108,15.68 180 top
Q21  112.49,34.3 0 top
Q22  103.92,34.36 0 top
Q23  124.15,15.62 180 top
Q24  122.35,30.77 0 top
Q25  129.92,30.76 0 top
Q26  28.4,47.62 180 top
R1  142.87,101.68 90 top
R2  145.04,101.7 90 top
R3  126.71,63.41 270 top
R4  38.84,102.87 180 top
R5  31.86,102.87 180 top
R6  39.46,96.9 180 top
R7  83.18,106.96 0 top
R8  83.27,104.88 180 top
R9  56.64,144.08 90 top
R10  63.97,143.22 90 top
R11  70.59,143.2 90 top
R12  77.49,143.22 90 top
R13  31.97,96.91 180 top
R14  84.68,143.21 90 top
R15  -11.55,4.97 0 top  (outside the outline)
R16  29.57,63.43 180 top
R17  38.56,64.04 90 top
R18  39.51,85.04 180 top
R19  31.92,85.2 180 top
R20  54.08,69.51 180 top
R21  91.57,58.52 0 top
R22  65.19,104.74 180 top
R23  79.8,58.98 0 top
R24  57.7,104.63 180 top
R25  135.33,76.04 270 top
R26  135.97,70.44 180 top
R27  135.98,68.29 180 top
R28  132.91,75.64 90 bottom
R29  145.71,76.48 270 top
R30  141.05,81.15 180 top
R31  41.38,38.22 0 top
R32  40.67,28.21 0 top
R33  56.99,37.88 0 top
R34  57.37,28.38 180 top
R35  39.38,91.06 180 top
R36  31.89,91.26 180 top
R37  65.38,98.52 180 top
R38  57.71,98.58 180 top
R39  65.56,92.63 180 top
R40  57.73,92.61 180 top
R41  65.37,86.47 180 top
R42  57.73,86.42 180 top
R43  74.32,37.86 0 top
R44  75.03,28.3 180 top
R45  91.38,37.86 0 top
R46  91.81,28.43 180 top
R47  108.59,37.9 0 top
R48  107.41,28.06 180 top
R49  127.44,37.05 0 top
R50  124.7,25.34 180 top
R51  47.83,61.91 180 top
SJ1  130.56,125.92 0 top
SV1  132.98,62.9 0 top
SV2  132.82,87.32 0 top
SV3  75.9,113.72 90 top
SV4  25.46,115.51 270 top
U$2  129.6,122.5 270 top
X1  11.77,122.51 90 top
X2  98.28,138.33 270 top
X3  11.81,82.05 90 top

### Tracks (layer width: path | path; a pad name or v marks a point on that pad's centre or on a via)
3V3
  Top 0.406: U$2.3.3V_1 126.61,97.1 134.59,105.08 134.59,110.48 135.22,111.11 140.56,111.11 IC2.8
5V  (10 unrouted)
  Top 0.305: 89.97,110.89 IC12.16
  Bottom 0.305: R5.1 34.4,97.02 R13.1
  Bottom 0.406: R13.1 34.51,96.66 34.51,91.35 R36.1 | R24.1 R38.1 60.25,92.63
  Bottom 0.61: R5.1 34.51,102.76 34.51,96.66 | R13.1 34.51,91.35 | R36.1 34.46,91.22 R19.1 | R24.1 60.25,104.63 | 60.25,92.63 R40.1 R42.1
5V1  (via drill 0.45)  (2 unrouted)
  Top 0.305: v124.52,129.48 IC8.8
  Bottom 0.406: LED1.A 60.63,147.11 LED2.A 67.36,146.92 LED3.A 73.99,147.01 LED4.A 81.09,147.04 87.73,147.04 LED5.A 88.31,147.09 113.85,147.09 116.27,144.67 D10.C | v124.52,129.48 124.52,130.34 125.76,131.58
  Bottom 0.61: U$2.5V 123.05,102.18 125.76,104.89 125.76,131.58 125.76,132.24 124.13,133.87 117.59,133.87 D10.C
5V-USB  (1 unrouted)
A  (1 unrouted)
A0  (1 unrouted)
A1
  Top 0.406: U$2.PA_0 137.47,107.51 IC2.1 IC2.2
ACC  (2 unrouted)
  Bottom 0.406: 79.95,116.17 82.95,113.17 82.95,109.73 R7.2
  Bottom 0.61: Q11.C 41.66,32.51 43.82,30.34 55.28,30.34 55.39,30.45 | 55.39,30.45 Q3.C | 55.39,30.45 73.5,30.45 | Q8.C 73.5,30.45 | 73.5,30.45 89.89,30.45 | 89.89,30.45 Q18.C | 89.89,30.45 107.38,30.45 Q21.C 109.95,31.68 112.13,29.5 Q24.C
AIN0
  Top 0.406: C2.1 31.86,101.6 | 31.86,101.6 35.03,101.6 R4.2 | 31.86,101.6 30.59,102.87 R5.2 26.71,102.87
AIN1
  Top 0.305: R13.2 30.76,95.59 30.76,95.43 | 30.76,95.43 C8.1 | 30.76,95.43 31.1,95.77 36.29,95.77 36.92,96.41 R6.2
  Bottom 0.406: 29.43,98.66 R13.2
AIN2
  Top 0.406: R36.2 30.89,89.72 | C24.1 30.74,88.57 30.74,89.72 30.89,89.72 | 30.89,89.72 35.56,89.72 36.84,91 R35.2
  Bottom 0.406: R36.2 27.93,92.68 27.93,98.08
AIN3
  Top 0.406: R19.2 30.54,84.04 | 30.54,84.04 C20.1 | 30.54,84.04 30.72,83.86 35.79,83.86 R18.2
  Bottom 0.406: R19.2 26.83,87.75 26.83,97.09
AIN4
  Top 0.406: R24.2 55.4,104.63 56.59,103.45 57.73,103.45 | R22.2 61.36,103.45 57.73,103.45 | 57.73,103.45 C22.1 50.37,101.79 47.08,98.51 29.65,98.51
AIN5
  Top 0.406: R37.2 61.58,97.26 57.68,97.26 | 57.68,97.26 56.32,95.9 C26.1 | 57.68,97.26 56.49,97.26 R38.2 53.31,96.71 51.82,96.71 47.44,92.33 30.61,92.33 28.18,94.76 28.18,98.22
AIN6
  Top 0.406: 57.46,91.33 57.46,91.07 C28.1 | 57.46,91.33 56.15,91.33 55.19,92.29 R40.2 53.92,92.61 47.84,86.53 27.55,86.53 26.71,87.37 26.71,97.96 | 57.46,91.33 61.72,91.33 R39.2
AIN7
  Top 0.406: R42.2 56.44,85.17 57.68,85.17 | R41.2 61.53,85.17 57.68,85.17 | C30.1 57.68,85.17
  Bottom 0.406: R42.2 52.51,83.74 29.14,83.74 26.17,86.71 26.17,96.36
AOUT0  (via drill 0.35)
  Top 0.406: C7.1 41.37,102.86 R4.1 D3.C | IC3.2 77.79,98.22 76.06,99.96 53.6,99.96 53.02,99.38 v53.02,99.36
  Bottom 0.406: v53.02,99.36 48.07,99.36 D3.C
AOUT1  (via drill 0.35)
  Top 0.305: C9.1 40.89,95.79 R6.1 44.54,96.9 D5.C
  Top 0.406: IC3.3 73.52,96.95 71.2,94.64 53.03,94.64 52.61,95.05 v52.24,95.05
  Bottom 0.406: v52.24,95.05 46.49,95.05 D5.C
AOUT2  (via drill 0.35)
  Top 0.406: C25.1 40.83,89.97 R35.1 43.85,91.06 D19.C | IC3.4 73.9,95.68 72.07,93.86 53.14,93.86 52.97,93.86 52.65,93.86 v52.3,93.51
  Bottom 0.406: v52.3,93.51 46.31,93.51 D19.C
AOUT3  (via drill 0.35)
  Top 0.406: C21.1 41.16,84.15 R18.1 D8.C | v53.15,87.84 67.59,87.84 72.48,92.74 72.61,92.74 74.28,94.41 IC3.5
  Bottom 0.406: D8.C 46.94,87.87 53.13,87.87 v53.15,87.84
AOUT4  (via drill 0.4)
  Top 0.406: R22.1 67.73,102.79 | 67.73,102.79 67.73,102.77 68.43,102.08 D17.C | C23.1 67.73,102.79 | IC3.6 77.07,93.14 v77.02,93.18
  Bottom 0.406: v77.02,93.18 75.75,94.45 72.65,94.45 71.41,95.69 71.41,100.22 69.55,102.08 D17.C
AOUT5  (via drill 0.4)
  Top 0.406: C27.1 67.92,97.19 R37.1 | IC3.7 78.31,91.87 v78.24,91.95
  Bottom 0.305: 69.28,95.07 67.92,96.43 R37.1 69.37,98.52 D24.C
  Bottom 0.406: v78.24,91.95 72.4,91.95 69.28,95.07
AOUT6
  Top 0.406: R39.1 68.1,90.97 66.9,89.77 C29.1 | IC3.8 77.54,90.6 76.66,91.49 72.95,91.49 D28.C
  Bottom 0.406: R39.1 70.81,89.92 D28.C
AOUT7
  Top 0.406: 67.91,85.08 R41.1 75.03,86.47 77.89,89.33 IC3.9 | 67.91,85.08 D29.C | C31.1 67.91,84.99 67.91,85.08
B  (1 unrouted)
C  (1 unrouted)
D  (1 unrouted)
D+  (1 unrouted)
D-  (1 unrouted)
GNC/GLP_MODE  (1 unrouted)
GND  (2 unrouted)
  Top 1.27: F2.1 14.15,25.22 14.15,26.65 P3.1
  Bottom 1.27: F2.1 14.08,25.29 14.08,26.72 P3.1
  pour Top: -0.81,22.51 13.07,22.51 15.46,24.9 20.42,24.9 23.14,27.61 23.21,27.64 149.45,27.64 149.45,141.68 140.65,150.48 1.26,150.48 -0.81,148.42
  pour Top: 0.84,21.28 -0.45,19.99 -0.45,1.53 1.1,-0.02 147.86,-0.02 149.72,1.84 149.72,26.24 23.12,26.24 21,24.13 17.33,24.13 14.5,21.29 0.84,21.29
GND2
  Bottom 1.27: Q23.S 119.01,21.97 115.03,25.94 101.55,25.94 | F2.2 24.52,21.12 29.34,25.94 34.82,25.94 | 101.55,25.94 85.04,25.94 | 85.04,25.94 68.89,25.94 | 68.89,25.94 52.21,25.94 | 52.21,25.94 34.82,25.94 | Q6.S 34.82,25.94 | Q1.S 52.21,25.94 | Q7.S 68.89,25.94 | Q14.S 85.04,25.94 | Q20.S 101.55,25.94
IAC_A
  Top 0.61: 25.15,115.51 SV4.4
INY1
  Top 1.27: P1.1 16.61,5.73 30.6,5.73 D25.C 30.65,7.28 41.33,17.96 41.33,21.95 Q6.D
INY2
  Top 1.27: P1.2 11.28,9.77 11.28,4.29 12.95,2.62 32.85,2.62 48.23,18 D1.C
  Bottom 1.27: Q1.D 58.73,20.19 56.54,18 D1.C
INY3
  Top 1.27: D4.C 75.38,13.89 Q7.D
  Bottom 1.27: P1.3 16.64,14.08 16.64,6.81 20.2,3.25 31.45,3.25 38.37,10.17 63.18,10.17 D4.C
INY4
  Top 1.27: Q14.D 91.6,17.52 83.53,9.45 83.53,5.88 D6.C
  Bottom 1.27: P1.4 31.54,8.32 35.27,12.05 76.79,12.05 82.95,5.88 D6.C
INY5
  Top 1.27: D7.C 108.01,14.16 Q20.D
  Bottom 1.27: P1.5 20.62,11.42 31.38,11.42 33.74,13.78 91.91,13.78 D7.C
INY6
  Top 1.27: D16.C 124.15,14.29 Q23.D
  Bottom 1.27: P1.6 24.9,16.7 25.92,15.68 106,15.68 D16.C
L5  (1 unrouted)
LAMB0OUT  (1 unrouted)
  Top 0.305: C17.1 133.39,68.24 R27.2 134.29,68.29 137.28,71.28 IC9.1
LAMB1OUT  (1 unrouted)
  Top 0.305: R30.2 138.51,78.63 IC9.7
  Bottom 0.305: R30.2 141.98,77.68 C19.1
M1  (1 unrouted)
M2  (1 unrouted)
M3  (1 unrouted)
M4  (1 unrouted)
MOSI
  Bottom 0.305: 121.27,109.8 U$2.PB_7
N$1
  Top 0.305: C18.1 141.29,81.53 141.18,81.43 141.18,78.69 IC9.5
  Bottom 0.305: R28.2 132.91,79.69 135.43,82.21 139.82,82.21 C18.1
N$2
  Top 0.305: Q12.B 36.3,32.82 R31.1 37.85,36.67 41.68,36.67 44.2,34.16 Q11.B
N$3
  Top 0.305: Q12.E 41.1,30.55 43.4,30.55 R32.2 46.74,29.2 Q11.E
N$4  (1 unrouted)
N$5
  Top 0.305: Q5.B 51.91,33.52 R33.1 56.96,37.88 60.53,34.31 Q3.B
N$6
  Top 0.305: Q6.G 43.89,26.03 42.95,26.96 39.32,26.96 38.07,28.21 R32.1
N$7  (1 unrouted)
N$8  (1 unrouted)
N$9
  Top 0.305: R34.2 54.86,30.95 | 54.86,30.95 54.95,31.04 Q5.E | Q3.E 60.97,30.95 54.86,30.95
N$10
  Top 0.305: Q1.G 61.27,27.2 R34.1
N$11
  Top 0.406: IC2.3 144.7,105.34 | 144.7,105.34 144.7,104.58 R2.2 | R1.2 144,105.34 144.7,105.34
N$12  (1 unrouted)
N$13  (1 unrouted)
N$14  (1 unrouted)
N$15  (1 unrouted)
N$16  (1 unrouted)
N$17  (1 unrouted)
N$18
  Top 0.305: Q13.B R43.1 69.24,36.93 70.33,35.84 76.89,35.84 78.71,34.03 Q8.B
N$19  (1 unrouted)
N$20
  Top 0.305: R44.2 71.78,30.13 Q13.E 73.93,30.86 79.62,30.86 81.25,32.49 Q8.E
N$25  (1 unrouted)
N$27
  Top 0.305: R44.1 77.92,26.11 Q7.G
N$28
  Top 0.305: Q18.B 92.69,35.51 88.25,35.51 | 88.25,35.51 86.3,37.46 R45.1 | Q19.B 87.4,34.66 88.25,35.51
N$29  (1 unrouted)
N$30
  Top 0.305: Q19.E 89.94,31.7 | 89.94,31.7 89.94,30.31 88.07,28.43 R46.2 | Q18.E 97.63,31.73 96.66,30.76 90.87,30.76 89.94,31.7
N$31
  Top 0.305: IC9.3 139.82,71.26 C16.1
  Bottom 0.305: R25.2 137.57,73.5 C16.1
N$32
  Top 0.305: R26.1 138.51,73.36 IC9.2
  Bottom 0.305: R27.1 138.51,68.3 R26.1
N$33
  Top 0.305: Q14.G 94.14,25.68 R46.1
N$34
  Top 0.305: IC8.7 128.61,130.75 129.7,129.66 129.7,126.32 SJ1.1
N$35  (1 unrouted)
N$36  (1 unrouted)
N$37
  Top 0.305: R30.1 143.59,81.14 R29.1 145.76,78.97 145.76,77.82 144.33,76.4 140.62,76.4 139.82,77.2 IC9.6
N$42  (via drill 0.35)
  other vias: 138.49,133.93
N$43  (via drill 0.35)
  other vias: 142.3,133.93
N$44  (via drill 0.35)
  other vias: 140.29,135.24
N$45  (via drill 0.35)
  other vias: 140.52,132.65
N$46
  Top 0.305: R47.1 105.45,35.96 | 105.45,35.96 105.66,35.75 109.78,35.75 Q21.B | Q22.B 103.92,34.43 105.45,35.96
N$47
  Top 0.305: R48.2 104.11,28.06 106.46,30.42 Q22.E 106.46,31.69 107.65,30.51 112.51,30.51 Q21.E
N$48
  Top 0.305: R48.1 110.55,26.12 Q20.G
N$49
  Top 0.305: Q24.B 122.28,29.44 122.28,28.6 123.86,27.02 128.51,27.02 129.92,28.43 Q25.B
  Bottom 0.305: Q24.B 122.28,29.57 122.28,36.96 R49.1
N$50
  Bottom 0.305: R50.2 121.59,25.34 124.86,28.61 124.86,29.8 124.89,29.78 Q24.E 124.89,30.54 125.7,31.35 131.21,31.35 132.46,30.1 Q25.E
N$52
  Bottom 0.305: R50.1 126.92,25.34 126.69,25.11 Q23.G
RCK  (1 unrouted)
RL1  (1 unrouted)
RL1IN
  Top 0.813: J1.1 18.77,38.24 19.54,39.01 19.54,41.88 D9.C 27.52,45.34 28.4,46.22 Q26.C
RL2  (1 unrouted)
  Top 0.305: R17.1 38.67,61.39
RL2IN  (via drill 0.9)
  Top 0.61: Q9.C 56.79,46.72 55.55,45.48 D12.C 51.85,45.09
  Top 0.813: 51.85,45.09 49.4,42.65 22.8,42.65 20.9,40.75 v20.9,40.53 | v15.4,40.73 J1.2
  Bottom 0.813: v15.4,40.73 20.7,40.73 v20.9,40.53
RL3  (1 unrouted)
RL3IN  (1 unrouted)
  Bottom 0.813: J1.3 20.25,43.24 23.89,39.59 26.56,39.59 29.28,42.31 78.54,42.31 D13.C
RL4  (1 unrouted)
RL4IN  (via drill 0.85)
  Top 0.61: D14.C 41.27,45.41 42.72,46.86 Q15.C
  Top 0.813: J1.4 10.63,37.21 11.88,35.95 19.1,35.95 24.11,40.95 v24.92,40.95
  Bottom 0.813: v24.92,40.95 27.4,43.43 35.75,43.43 37.26,44.94 D14.C
RL5  (1 unrouted)
RL5IN
  Top 0.61: D15.C 68.87,45.31 71.06,47.5 Q16.C
  Top 0.813: J1.5 9.67,40.74 8.55,39.62 8.55,36.85 11.03,34.37 21.08,34.37 28.14,41.43 62.39,41.43 D15.C
RL6IN  (1 unrouted)
  Bottom 0.813: J1.6 9.51,43.24 8.01,41.74 8.01,37.73 11.35,34.39 23.57,34.39 30.07,40.89 92.37,40.89 D20.C
RX
  Bottom 0.406: U$2.PA_9 | U$2.PA_9 PROG.3
SCK2  (1 unrouted)
  Top 0.406: IC11.11 87.61,116.13
SCL  (via drill 0.65)
  Top 0.406: v129.94,132.09 129.88,132.02 IC8.6
  Bottom 0.406: DISPLAY.4 141.67,135.2 139.13,132.66 U$2.PB_10 130.51,132.66 v129.94,132.09
SDA
  Top 0.305: U$2.PB_11 129.54,135.2 IC8.5
  Top 0.406: U$2.PB_11 139.13,135.2 141.67,132.66 DISPLAY.3
TX
  Bottom 0.406: U$2.PA_10 | U$2.PA_10 PROG.2
VBAT
  Top 0.406: IC3.21 87.48,95.68 83.75,99.42 83.75,102.79 81.65,104.88 R8.2
  Bottom 0.406: R8.2 80.73,106.87 R7.1 80.64,109.78 D27.C